# Altium project FOC_DriveBoard.PrjPcb
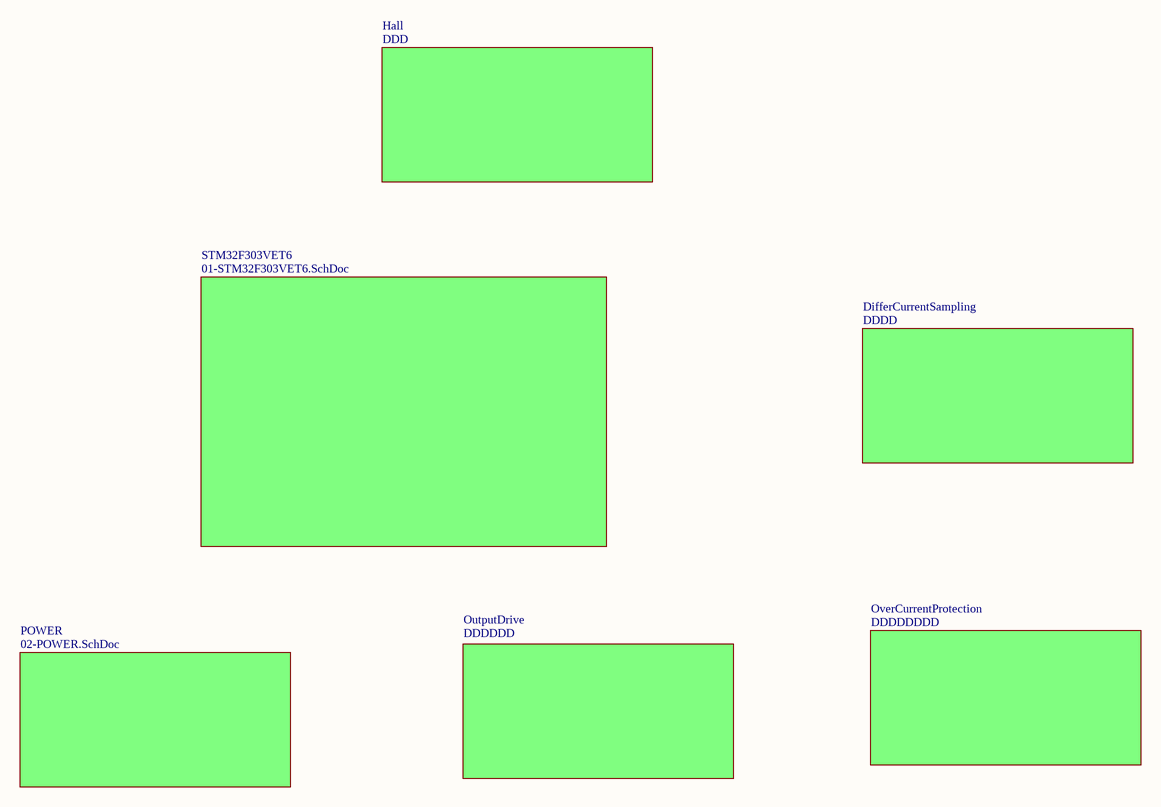
[diagram p0: 00-FOC_DriveBoard.SchDoc]
3 sheets, 19 parts. Net scope: flat (ports and power ports of the same name join across sheets).
Sheets:
  00-FOC_DriveBoard.SchDoc
    STM32F303VET6 = 01-STM32F303VET6.SchDoc
    POWER = 02-POWER.SchDoc

## Sheet 00-FOC_DriveBoard.SchDoc
size A4

### Sub-sheets
DifferCurrentSampling = DDDD (file not in this document): no entries
Hall = DDD (file not in this document): no entries
OutputDrive = DDDDDD (file not in this document): no entries
OverCurrentProtection = DDDDDDDD (file not in this document): no entries
POWER = 02-POWER.SchDoc: no entries
STM32F303VET6 = 01-STM32F303VET6.SchDoc: no entries

## Sheet 01-STM32F303VET6.SchDoc
size A
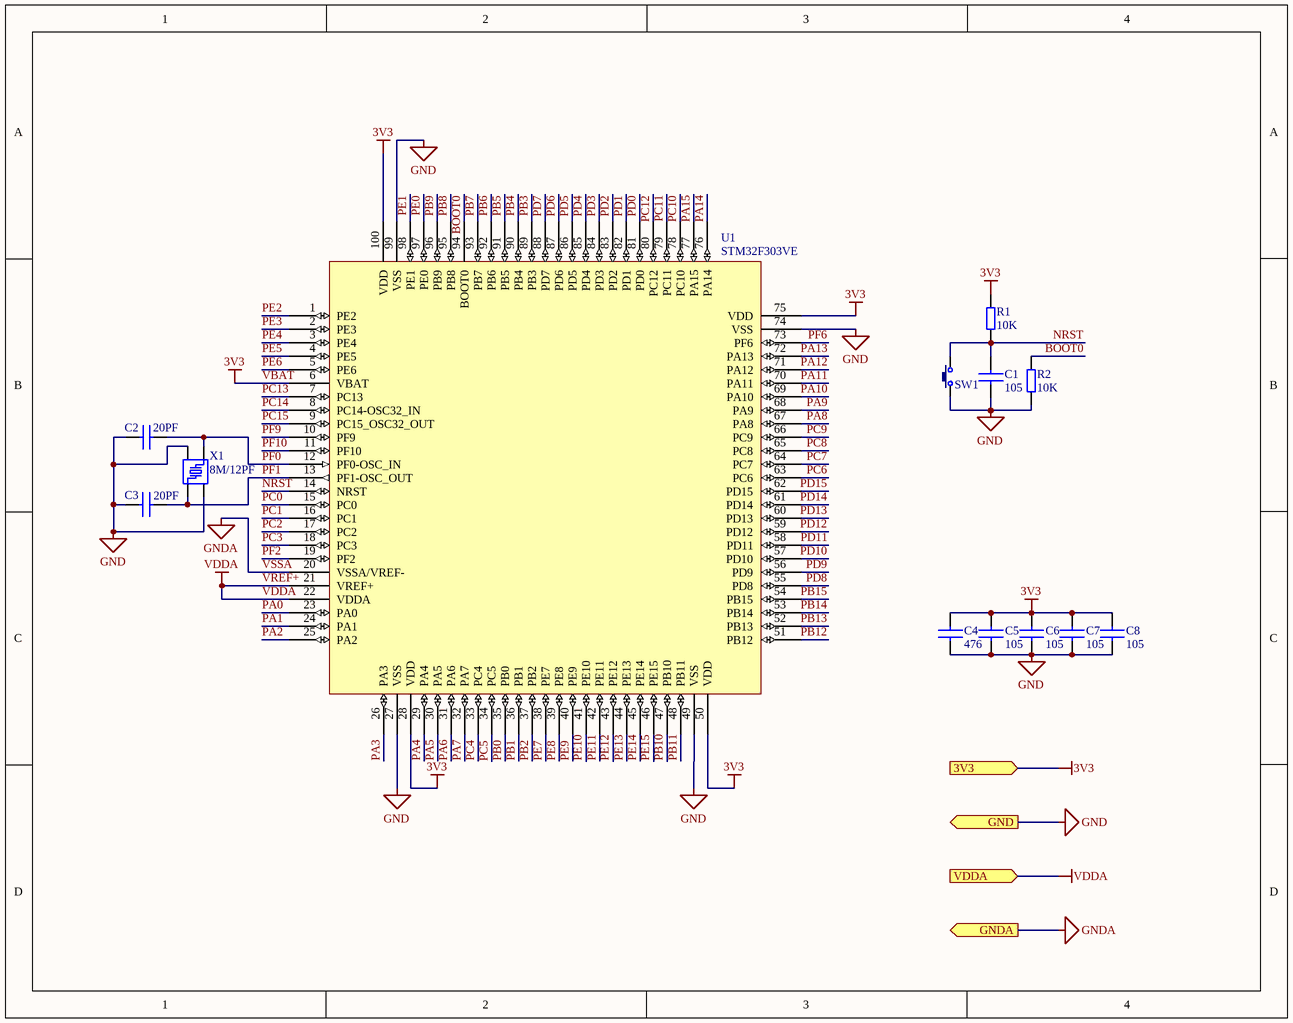
[diagram p1: 01-STM32F303VET6.SchDoc]

### Parts
C1  105  [C0603]
C2  20PF  [C0603]
C3  20PF  [C0603]
C4  476  [C0805]
C5  105  [C0603]
C6  105  [C0603]
C7  105  [C0603]
C8  105  [C0603]
R1  10K  [R0603]
R2  10K  [R0603]
SW1  SW3*6*2.5  [SMD-3*6*2.5]  (value not drawn)
U1  STM32F303VE  [LQFP-100]
X1  8M/12PF  [SMD3225-4P]

### Ports
3V3 (in), GND (out), GNDA (out), VDDA (in)

### Nets
GND: C1.2 C2.1 C3.1 C4.2 C5.2 C6.2 C7.2 C8.2 R2.1 SW1.1 U1.27(VSS) U1.49(VSS) U1.74(VSS) U1.99(VSS) X1.2 X1.4 ; port GND
VBAT: C4.1 C5.1 C6.1 C7.1 C8.1 R1.2 U1.6(VBAT) U1.28(VDD) U1.50(VDD) U1.75(VDD) U1.100(VDD) ; port 3V3  [also labelled 3V3]
VDDA: U1.21(VREF+) U1.22(VDDA) ; port VDDA  [also labelled VREF+]
VSSA: U1.20(VSSA/VREF-) ; port GNDA  [also labelled GNDA]
BOOT0: R2.2 U1.94(BOOT0)
NRST: C1.1 R1.1 SW1.2 U1.14(NRST)
PA0: U1.23(PA0)
PA1: U1.24(PA1)
PA2: U1.25(PA2)
PA3: U1.26(PA3)
PA4: U1.29(PA4)
PA5: U1.30(PA5)
PA6: U1.31(PA6)
PA7: U1.32(PA7)
PA8: U1.67(PA8)
PA9: U1.68(PA9)
PA10: U1.69(PA10)
PA11: U1.70(PA11)
PA12: U1.71(PA12)
PA13: U1.72(PA13)
PA14: U1.76(PA14)
PA15: U1.77(PA15)
PB0: U1.35(PB0)
PB1: U1.36(PB1)
PB2: U1.37(PB2)
PB3: U1.89(PB3)
PB4: U1.90(PB4)
PB5: U1.91(PB5)
PB6: U1.92(PB6)
PB7: U1.93(PB7)
PB8: U1.95(PB8)
PB9: U1.96(PB9)
PB10: U1.47(PB10)
PB11: U1.48(PB11)
PB12: U1.51(PB12)
PB13: U1.52(PB13)
PB14: U1.53(PB14)
PB15: U1.54(PB15)
PC0: U1.15(PC0)
PC1: U1.16(PC1)
PC2: U1.17(PC2)
PC3: U1.18(PC3)
PC4: U1.33(PC4)
PC5: U1.34(PC5)
PC6: U1.63(PC6)
PC7: U1.64(PC7)
PC8: U1.65(PC8)
PC9: U1.66(PC9)
PC10: U1.78(PC10)
PC11: U1.79(PC11)
PC12: U1.80(PC12)
PC13: U1.7(PC13)
PC14: U1.8(PC14-OSC32_IN)
PC15: U1.9(PC15_OSC32_OUT)
PD0: U1.81(PD0)
PD1: U1.82(PD1)
PD2: U1.83(PD2)
PD3: U1.84(PD3)
PD4: U1.85(PD4)
PD5: U1.86(PD5)
PD6: U1.87(PD6)
PD7: U1.88(PD7)
PD8: U1.55(PD8)
PD9: U1.56(PD9)
PD10: U1.57(PD10)
PD11: U1.58(PD11)
PD12: U1.59(PD12)
PD13: U1.60(PD13)
PD14: U1.61(PD14)
PD15: U1.62(PD15)
PE0: U1.97(PE0)
PE1: U1.98(PE1)
PE2: U1.1(PE2)
PE3: U1.2(PE3)
PE4: U1.3(PE4)
PE5: U1.4(PE5)
PE6: U1.5(PE6)
PE7: U1.38(PE7)
PE8: U1.39(PE8)
PE9: U1.40(PE9)
PE10: U1.41(PE10)
PE11: U1.42(PE11)
PE12: U1.43(PE12)
PE13: U1.44(PE13)
PE14: U1.45(PE14)
PE15: U1.46(PE15)
PF0: C2.2 U1.12(PF0-OSC_IN) X1.3
PF1: C3.2 U1.13(PF1-OSC_OUT) X1.1
PF2: U1.19(PF2)
PF6: U1.73(PF6)
PF9: U1.10(PF9)
PF10: U1.11(PF10)

### Library data of the parts
C1-C8 = C: 电容; Coding: 41170010
R1 R2 = R: 电阻; Coding: 41180035
SW1 = SW3*6*2.5: 3*6*2.5轻触开关; BOM名称: 直插6x6轻触开关; 版权归属: 源创客; 学习资源: www.ooocke.com
U1 = STM32F303VE: 主控
X1 = XTAL: 晶振; Coding: 41230021

## Sheet 02-POWER.SchDoc
size A
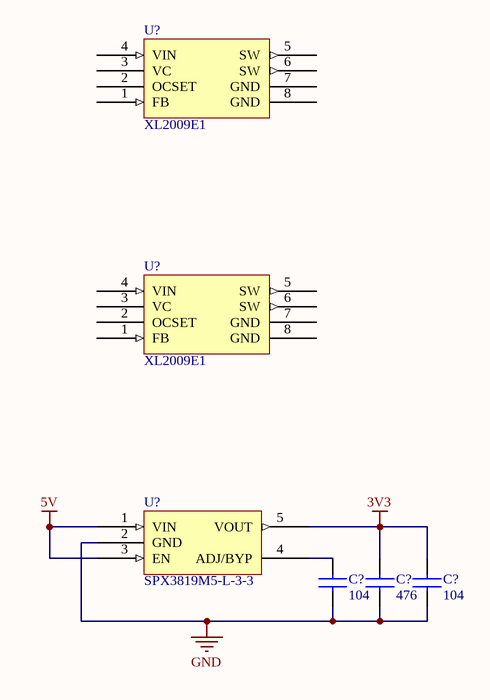
[diagram p2: 02-POWER.SchDoc]

### Parts
(Parts that share a designator on the sheet are numbered #1, #2 ... from top to bottom, then left to right.)
C?#1  104  [C0603]
C?#2  476  [C0805]
C?#3  104  [C0603]
U?#1  XL2009E1  [SOIC-8]
U?#2  XL2009E1  [SOIC-8]
U?#3  SPX3819M5-L-3-3  [SOT-23-5]

### Nets
3V3: C?#2.1 C?#3.1 U?#3.5(VOUT)  [project net VBAT]
5V: U?#3.1(VIN) U?#3.3(EN)
GND: C?#1.2 C?#2.2 C?#3.2 U?#3.2(GND)
NetC?#1_1: C?#1.1 U?#3.4(ADJ/BYP)

Not connected (* = marked no-connect by the designer): U?#1 1(FB) 2(OCSET) 3(VC) 4(VIN) 5(SW) 6(SW) 7(GND) 8(GND); U?#2 1(FB) 2(OCSET) 3(VC) 4(VIN) 5(SW) 6(SW) 7(GND) 8(GND)

### Library data of the parts
C?#1-C?#3 = C: 电容; Coding: 41170010
U?#1 U?#2 = XL2009E1: VIN->12V->5V
U?#3 = SPX3819M5-L-3-3: 5V->3.3V

## Nets that join several sheets
GND: 01-STM32F303VET6 (16 pins), 02-POWER (C?#1.2 C?#2.2 C?#3.2 U?#3.2)
VBAT: 01-STM32F303VET6 (11 pins), 02-POWER (C?#2.1 C?#3.1 U?#3.5)